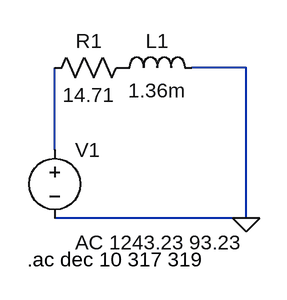
[diagram p0: schematic Task3-thev-eq.asc]
Task3-thev-eq.asc, the LTspice schematic file:
Version 4
SHEET 1 880 680
WIRE 384 64 320 64
WIRE 160 160 160 64
WIRE 384 240 384 64
WIRE 384 240 160 240
FLAG 384 240 0
SYMBOL voltage 160 144 R0
WINDOW 123 24 124 Left 2
WINDOW 39 0 0 Left 0
SYMATTR Value2 AC 1243.23 93.23
SYMATTR InstName V1
SYMATTR Value ""
SYMBOL res 144 80 R270
WINDOW 0 32 56 VTop 2
WINDOW 3 0 56 VBottom 2
SYMATTR InstName R1
SYMATTR Value 14.71
SYMBOL ind 224 80 R270
WINDOW 0 32 56 VTop 2
WINDOW 3 5 56 VBottom 2
SYMATTR InstName L1
SYMATTR Value 1.36m
TEXT 128 288 Left 2 !.ac dec 10 317 319

The netlist it stands for:
* Task3-thev-eq.asc
V1 N001 0 AC 1243.23 93.23
R1 N001 P001 14.71
L1 P001 0 1.36m
.ac dec 10 317 319
.backanno
.end

* Results of the author's LTspice run, read from the files saved beside the schematic
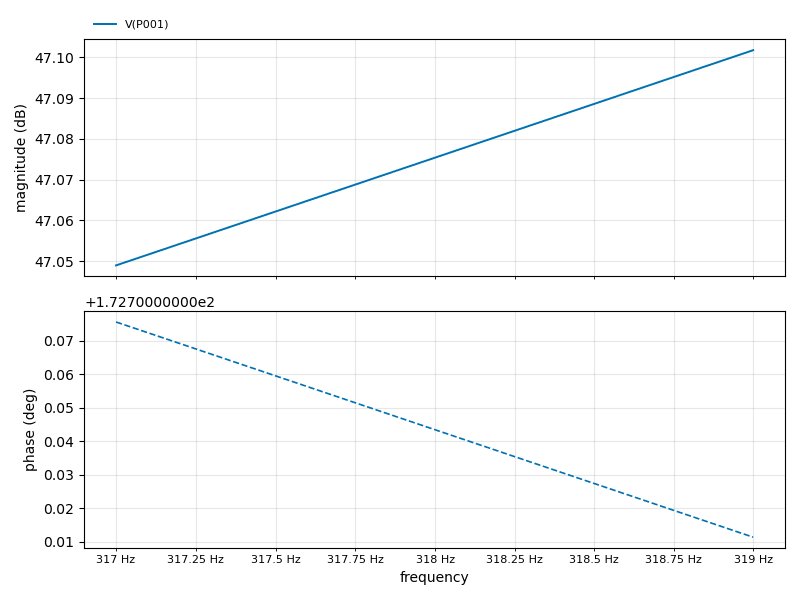
[diagram p1: AC Analysis of Task3-thev-eq.asc, plotted from the saved traces]
* AC Analysis, 1 run:
*   V(P001): 47.05 dB at 317 Hz, 47.10 dB at 319 Hz, peak 47.10 dB at 319 Hz